# Altium schematic sheet ESP8266.SchDoc
size A4; SheetNumber: 4; SheetTotal: 4
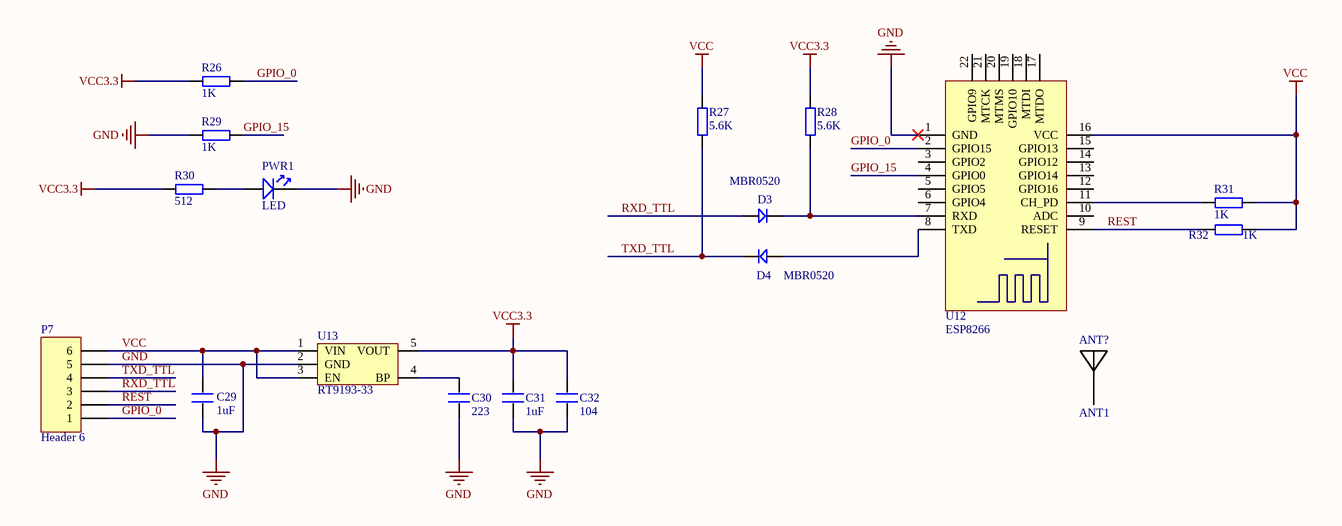
[diagram p0: ESP8266.SchDoc]

## Parts
ANT?  ANT1  [2.4GANTF0]
C29  1uF  [0603P]
C30  223  [0603P]
C31  1uF  [0603P]
C32  104  [0603P]
D3  MBR0520  [SOD-123]
D4  MBR0520  [SOD-123]
P7  Header 6  [HDR1X6]
PWR1  LED  [SMDLED]
R26  1K  [0603P]
R27  5.6K  [0603P]
R28  5.6K  [0603P]
R29  1K  [0603P]
R30  512  [0603P]
R31  1K  [0603P]
R32  1K  [0603P]
U12  ESP8266  [ESP8266]
U13  RT9193-33  [SOT-23-5]

## Nets
GND: C29.2 C30.2 C31.2 C32.2 P7.5 PWR1.2 R29.1 U12.1(GND) U13.2(GND)
VCC: C29.1 P7.6 R27.2 R31.2 R32.2 U12.16(VCC) U13.1(VIN) U13.3(EN)
VCC3.3: C31.1 C32.1 R26.1 R28.2 R30.1 U13.5(VOUT)
GPIO_0: P7.1 R26.2 U12.2(GPIO15)
GPIO_15: R29.2 U12.4(GPIO0)
REST: P7.2 R32.1 U12.9(RESET)
RXD_TTL: D3.1 P7.3
TXD_TTL: D4.2 P7.4 R27.1
NetC30_1: C30.1 U13.4(BP)
NetD3_2: D3.2 R28.1 U12.7(RXD)
NetD4_1: D4.1 U12.8(TXD)
NetPWR1_1: PWR1.1 R30.2
NetR31_1: R31.1 U12.11(CH_PD)

Not connected (* = marked no-connect by the designer): ANT? 1; U12 3(GPIO2) 5(GPIO5) 6(GPIO4) 10(ADC) 12(GPIO16) 13(GPIO14) 14(GPIO12) 15(GPIO13) 17(MTDO) 18(MTDI) 19(GPIO10) 20(MTMS) 21(MTCK) 22(GPIO9)

## Library data of the parts
ANT? = ANT1: PCB板载天线; 联系卖家，免费技术支持: 唯一出售店铺网址https://shop463601444.taobao.com; BOM名称: PCB板载天线
C29-C32 = C
D3 D4 = D: 1N4148
P7 = Header 6: Header, 6-Pin; LatestRevisionDate: 17-Jul-2002; LatestRevisionNote: Re-released for DXP Platform.; Publisher: Altium Limited
R26-R32 = R
U13 = RT9193-33: 3.3V超低压差LDO